# EasyEDA schematic SCH_AQUVIS-Power_2023-07-29.json
TITLE: Aquvis Power; REV: 1.0; Date: 2023-07-06; Sheet: 1/1; Drawn By: Shreesh Bajpai; Company: PIL
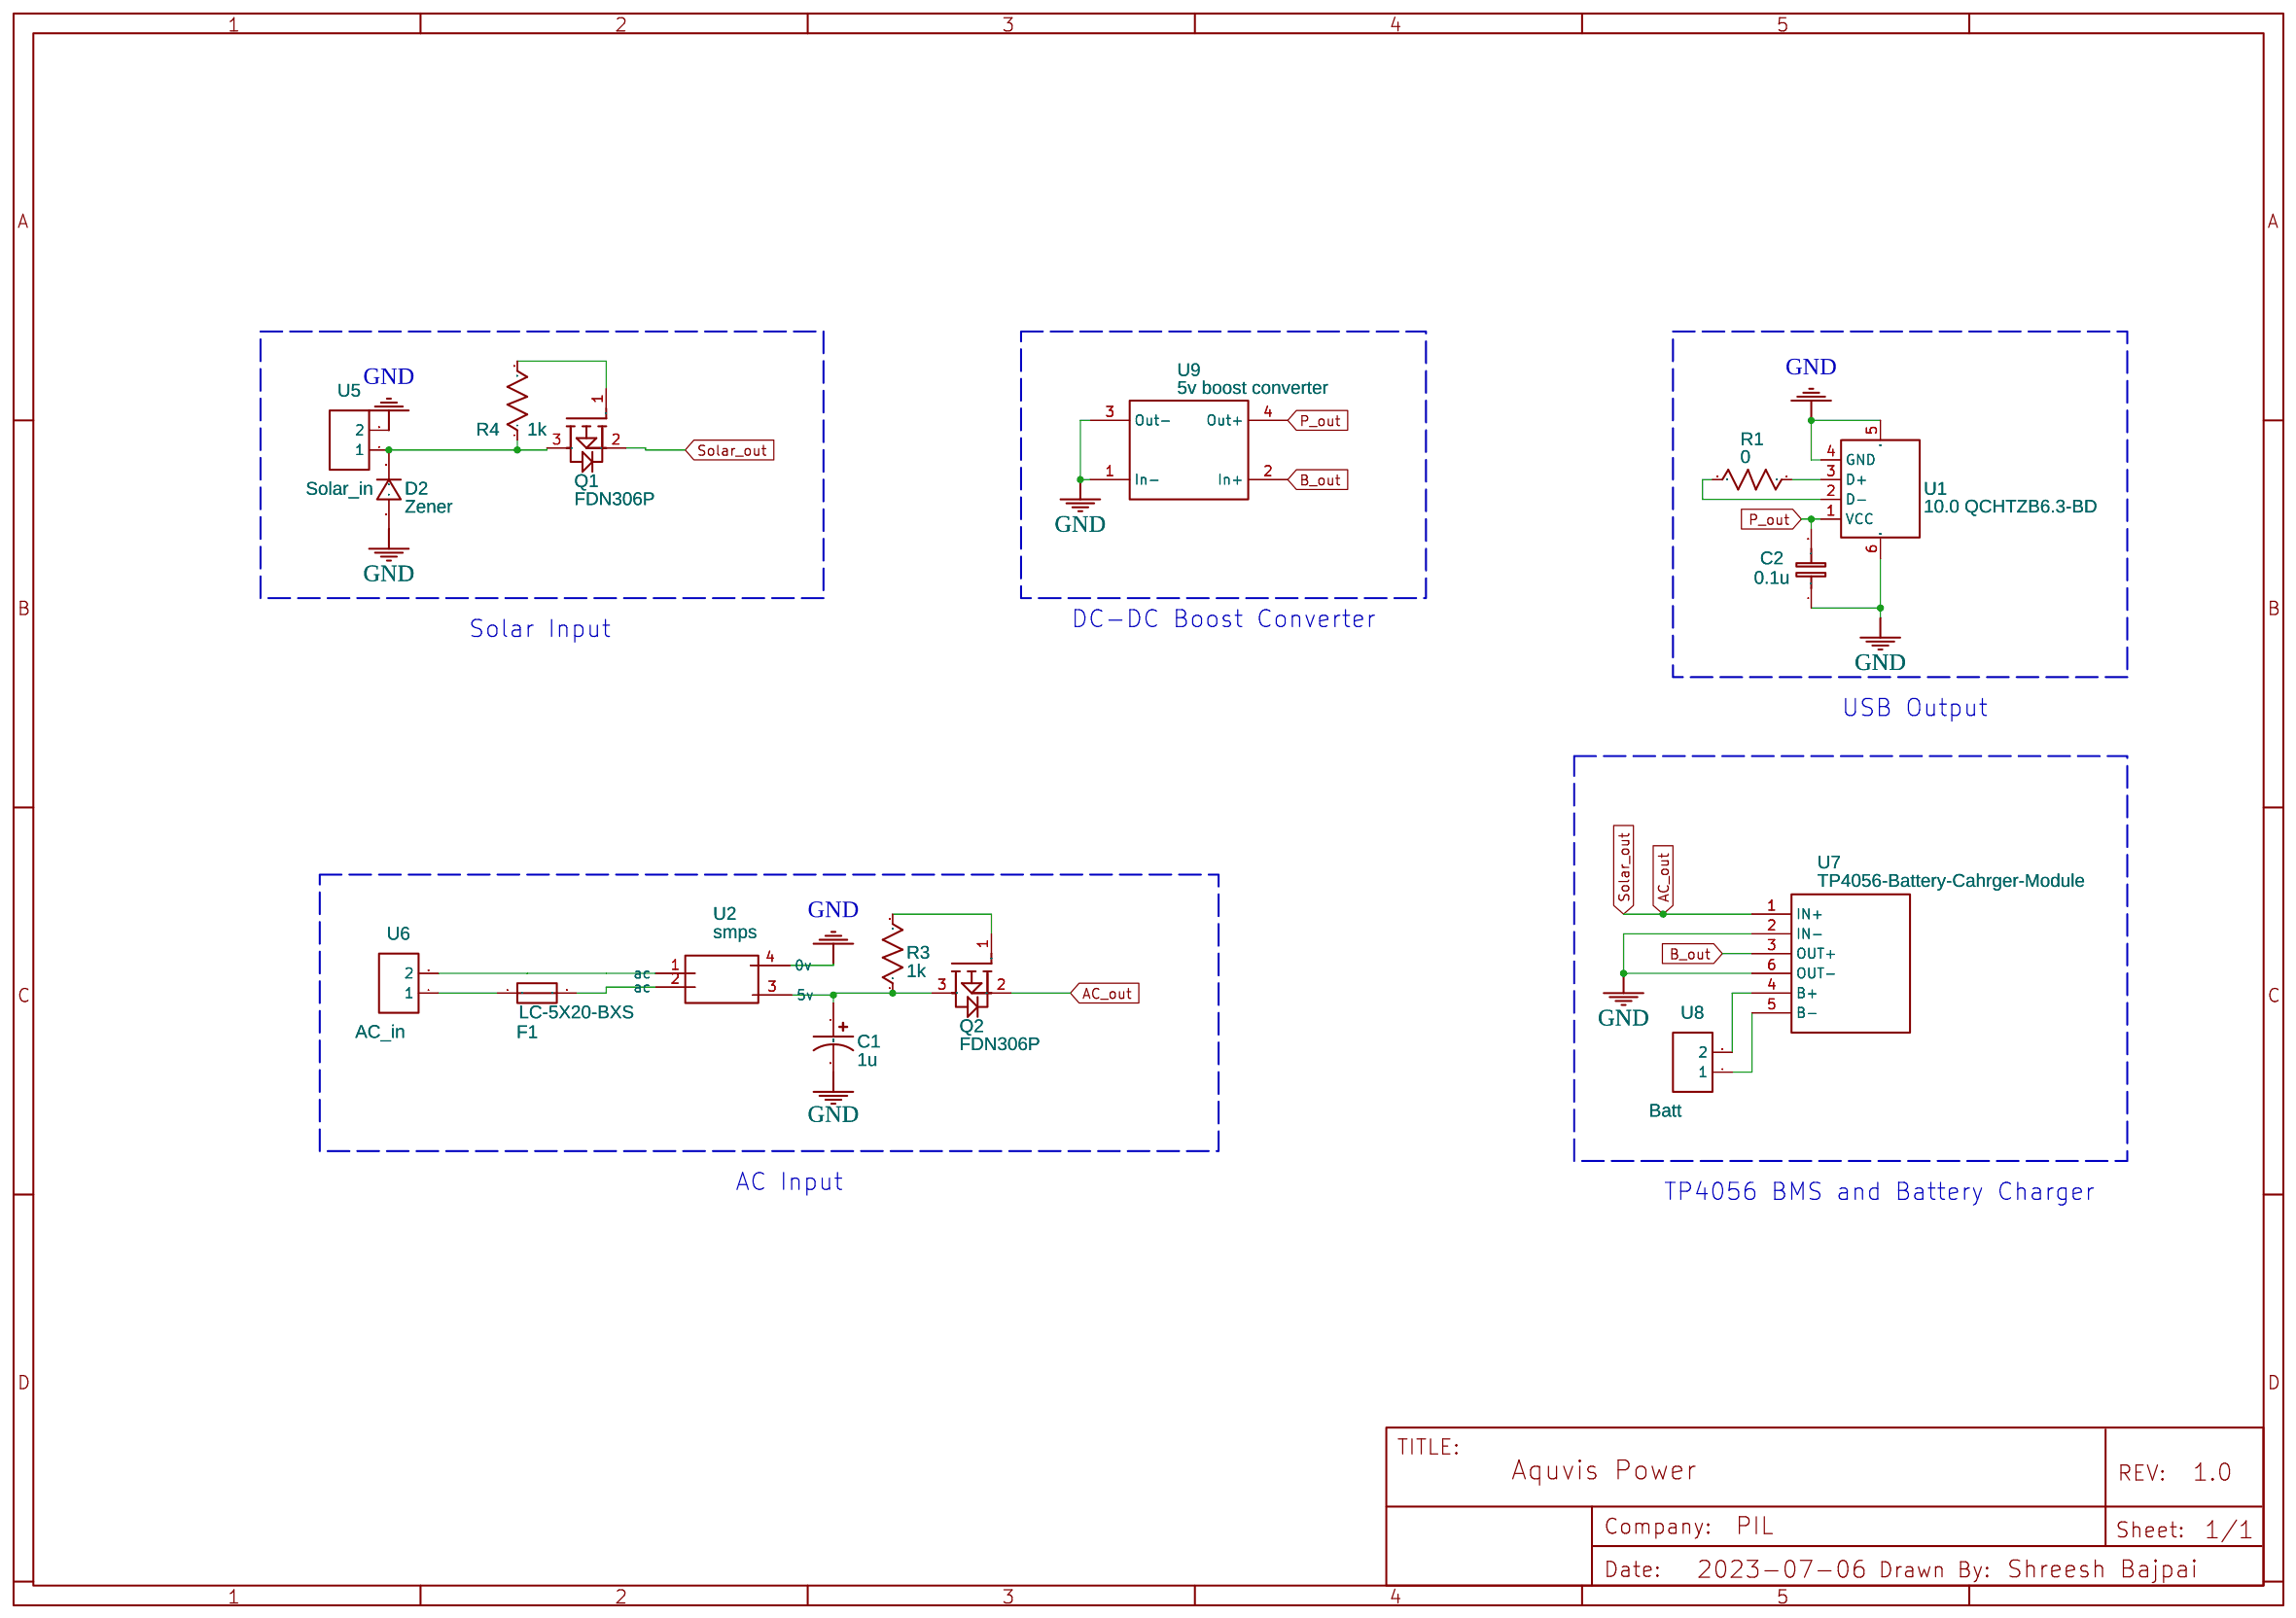
[diagram p0: schematic sheet]

## Parts
C1  1u  [CAP-D3.0×F1.5]
C2  0.1u  [RAD-0.1]
D2  Zener  [DO-35_BD2.0-L4.2-P8.20-D0.5-RD]
F1  LC-5X20-BXS  [FUSE-TH_LC-5X20-BXS]
Q1  FDN306P  [SOT-23]
Q2  FDN306P  [SOT-23]
R1  0  [R0805]
R3  1k  [R_AXIAL-0.3]
R4  1k  [R_AXIAL-0.3]
U1  10.0 QCHTZB6.3-BD  [USB-A-SMD_USB-A-SMD-4P]
U2  smps  [SMPS123]
U5  Solar_in  [BORNERA DOS TERMINALES TERMINAL BLOCK 5MM]
U6  AC_in  [BORNERA DOS TERMINALES TERMINAL BLOCK 5MM]
U7  TP4056-Battery-Cahrger-Module  [BATTERY-CHARGER-TP4056]
U8  Batt  [BORNERA DOS TERMINALES TERMINAL BLOCK 5MM]
U9  5v boost converter  [5V BOOST CONVERTER]

## Library data of the parts
C1 = CE_TH_D3.0×F1.5_US: Contributor: LCEDA_Lib
C2 = C_RAD-0.1_EU: Contributor: LCEDA_Lib
D2 = 1N4148: Supplier: LCSC; Supplier Part: C13769; Manufacturer: STMicroelectronics; Contributor: LCSC
F1 = LC-5X20-BXS: Supplier: LCSC; Supplier Part: C9900019069; Manufacturer: null; Manufacturer Part: LC-5x20-BXS; Contributor: lcsc
Q1 Q2 = FDN306P: SKU: 99-41-716-060026; Contributor: ทรงยศ ปิยะรัตน์
R1 = R_0805_US: Contributor: LCEDA_Lib
R3 R4 = R_AXIAL-0.3_US: Contributor: LCEDA_Lib
U1 = 10.0 QCHTZB6.3-BD: Supplier: LCSC; Supplier Part: C2681561; Manufacturer: SHOU HAN(首韩); link: https://atta.szlcsc.com/upload/public/pdf/source/20210107/C2681561_DD6486BFD5FDE8833C242795215B1CF6.pdf; JLCPCB Part Class: Extended Part; Contributor: lcsc
U2 = smps123: Manufacturer Part: 5V; Contributor: pon raghu; Package Display: No
U5 U6 U8 = TERMINAL BLOCK 2P: Contributor: DARIOELJATIB
U7 = TP4056-Battery-Cahrger-Module: Contributor: Emiliano Vena
U9 = 5v boost converter: link: https://www.aliexpress.com/item/32788045286.html?spm=a2g0s.9042311.0.0.27424c4d6UPPC1; Contributor: kulverstukas.k

## Nets
GND: C1.2 C2.1 D2.2 U1.4(GND) U1.5(SH1) U1.6(SH2) U2.4(0v) U5.2 U7.2(IN-) U7.6(OUT-) U9.1(In-) U9.3(Out-)
AC_out: Q1.2(S) Q2.2(S) U7.1(IN+)
B_out: U7.3(OUT+) U9.2(In+)
P_out: C2.2 U1.1(VCC) U9.4(Out+)
Net-(C1-1): C1.1 Q2.3(D) R3.1 U2.3(5v)
Net-(D2-1): D2.1 Q1.3(D) R4.1 U5.1
Net-(F1-1): F1.1 U6.1
Net-(F1-2): F1.2 U2.2(ac)
Net-(Q1-1): Q1.1(G) R4.2
Net-(Q2-1): Q2.1(G) R3.2
Net-(R1-1): R1.1 U1.3(D+)
Net-(R1-2): R1.2 U1.2(D-)
Net-(U2-1): U2.1(ac) U6.2
Net-(U7-4): U7.4(B+) U8.2
Net-(U7-5): U7.5(B-) U8.1

## Notes on the sheet
- Solar Input
- DC-DC Boost Converter
- USB Output
- AC Input
- TP4056 BMS and Battery Charger
